# Altium schematic sheet ADC.SchDoc
size A2; SheetNumber: 36; SheetTotal: 36
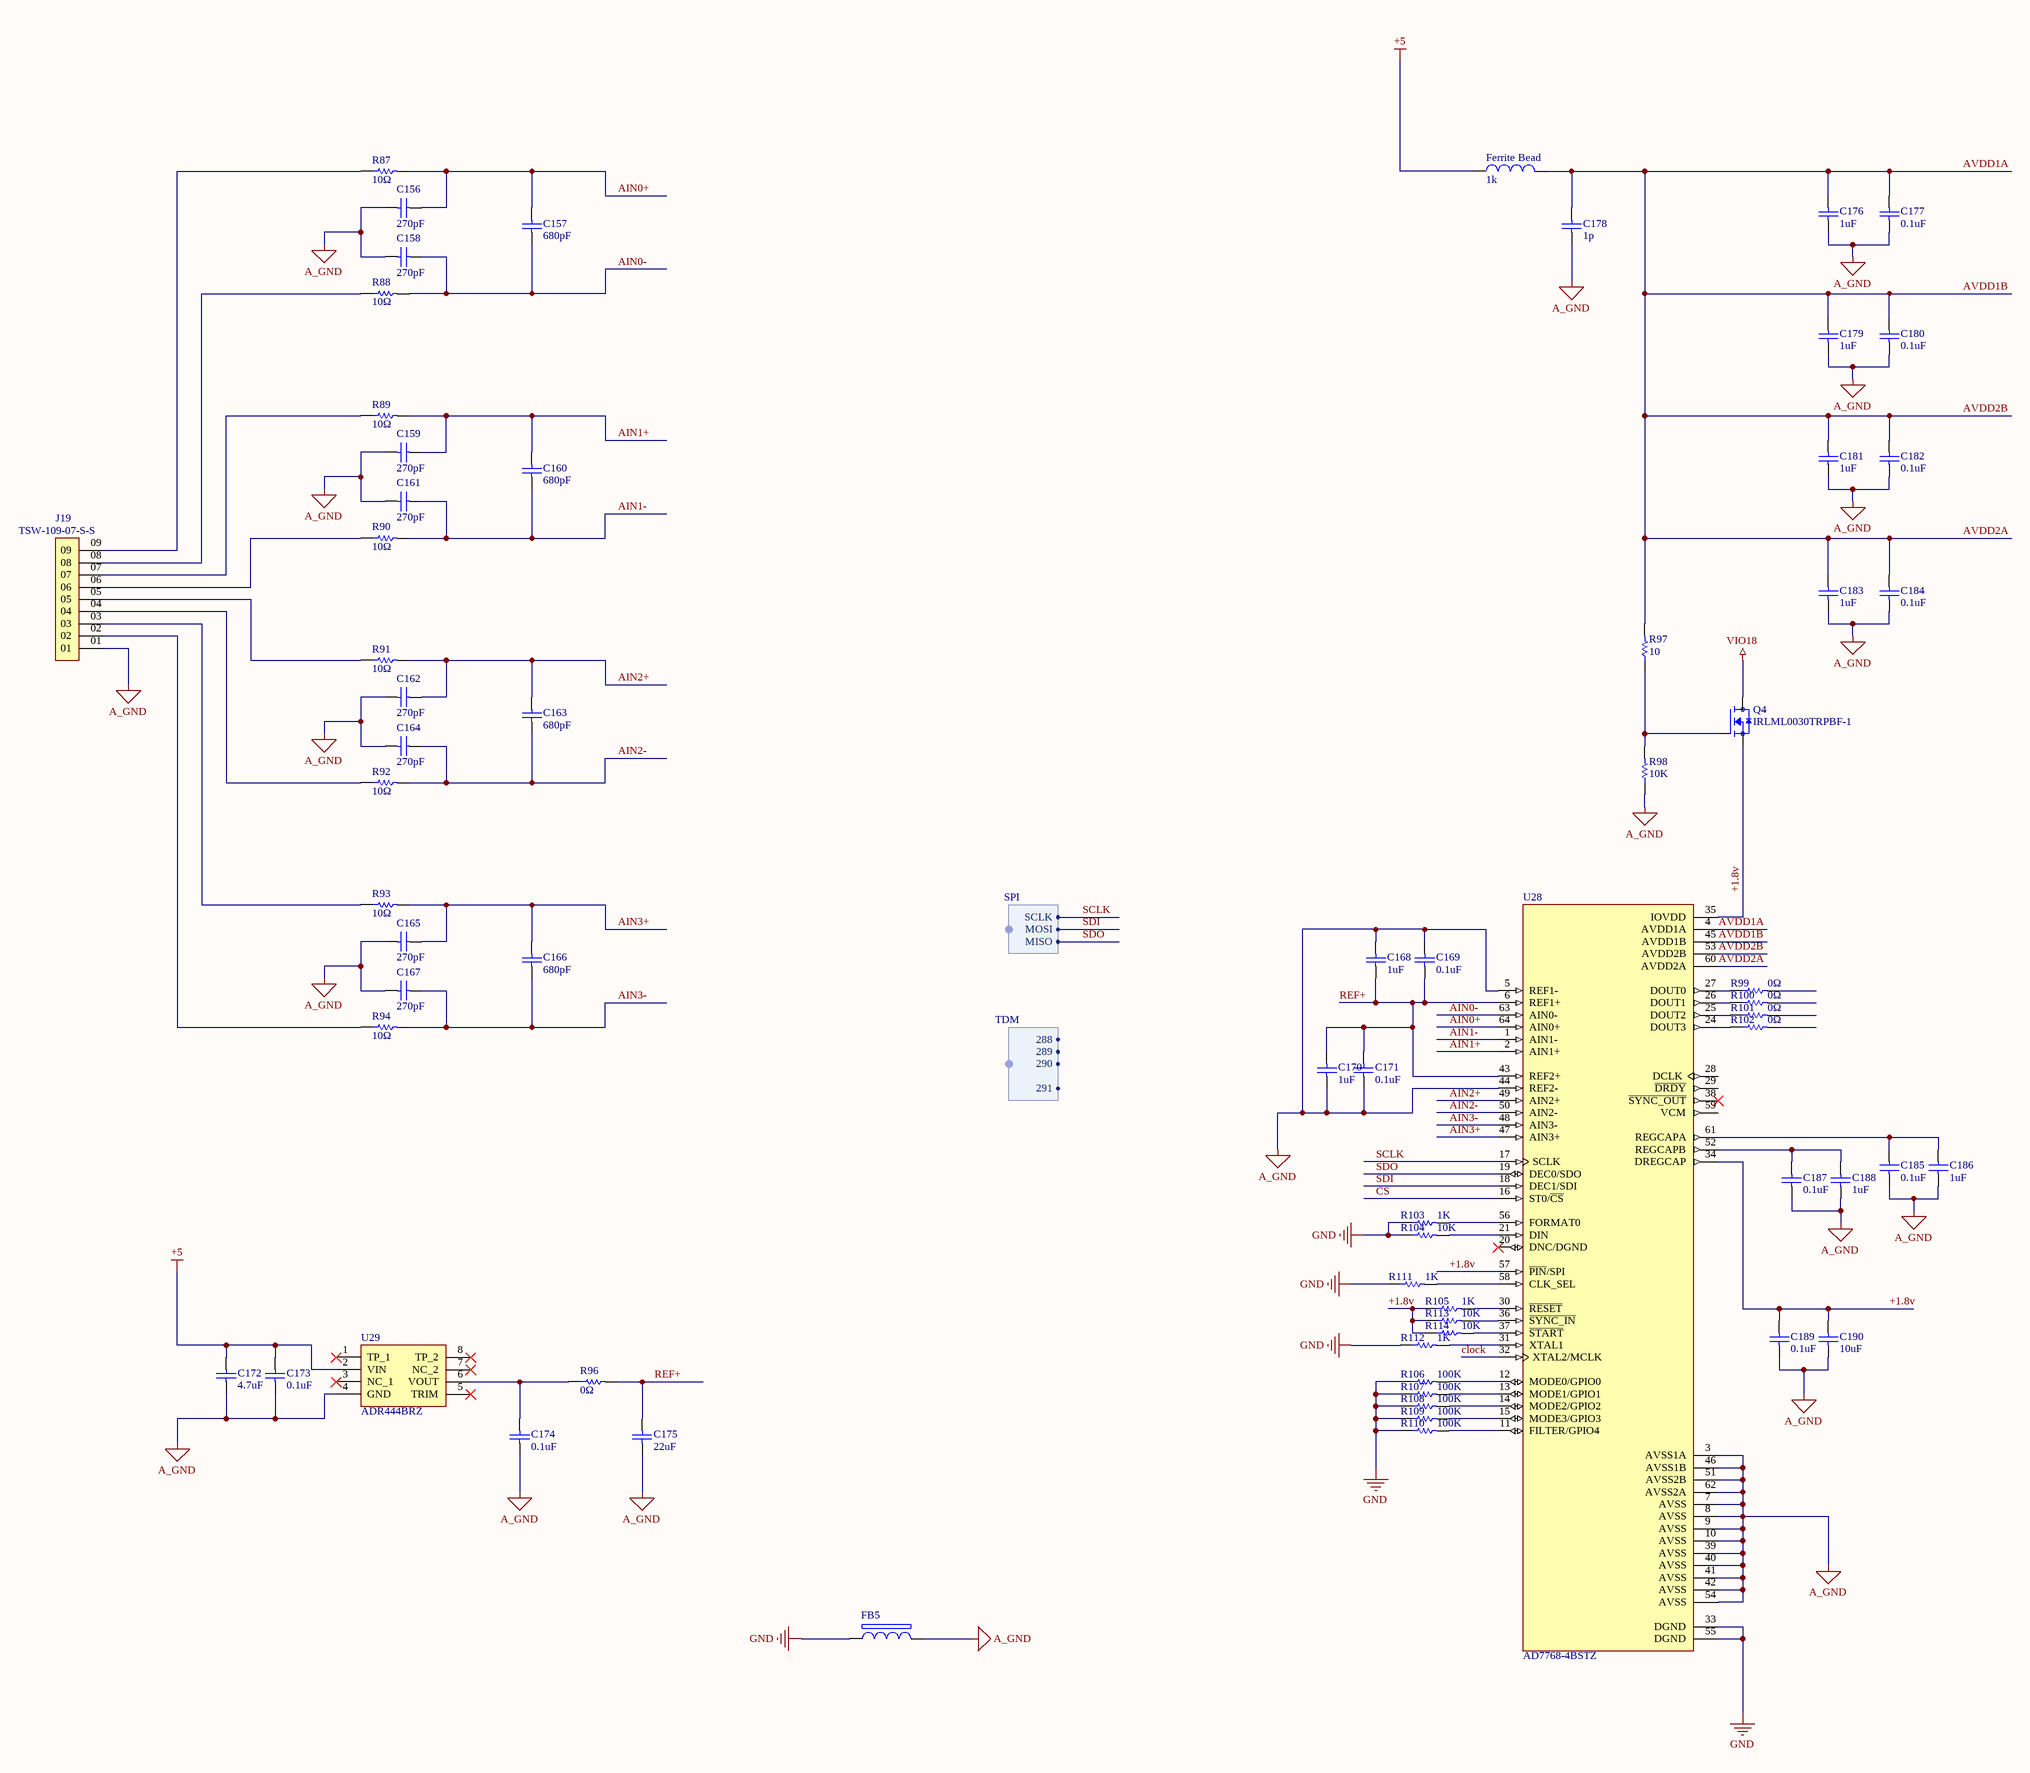
[diagram p0: ADC.SchDoc]

## Parts
C156  value 270pF  (hidden comment: Capacitor)
C157  value 680pF  (hidden comment: Capacitor)
C158  value 270pF  (hidden comment: Capacitor)
C159  value 270pF  (hidden comment: Capacitor)
C160  value 680pF  (hidden comment: Capacitor)
C161  value 270pF  (hidden comment: Capacitor)
C162  value 270pF  (hidden comment: Capacitor)
C163  value 680pF  (hidden comment: Capacitor)
C164  value 270pF  (hidden comment: Capacitor)
C165  value 270pF  (hidden comment: Capacitor)
C166  value 680pF  (hidden comment: Capacitor)
C167  value 270pF  (hidden comment: Capacitor)
C168  value 1uF  (hidden comment: Capacitor)
C169  value 0.1uF  (hidden comment: Capacitor)
C170  value 1uF  (hidden comment: Capacitor)
C171  value 0.1uF  (hidden comment: Capacitor)
C172  value 4.7uF  (hidden comment: Capacitor)
C173  value 0.1uF  (hidden comment: Capacitor)
C174  value 0.1uF  (hidden comment: Capacitor)
C175  value 22uF  (hidden comment: Capacitor)
C176  value 1uF  (hidden comment: Capacitor)
C177  value 0.1uF  (hidden comment: Capacitor)
C178  value 1p  (hidden comment: Capacitor)
C179  value 1uF  (hidden comment: Capacitor)
C180  value 0.1uF  (hidden comment: Capacitor)
C181  value 1uF  (hidden comment: Capacitor)
C182  value 0.1uF  (hidden comment: Capacitor)
C183  value 1uF  (hidden comment: Capacitor)
C184  value 0.1uF  (hidden comment: Capacitor)
C185  value 0.1uF  (hidden comment: Capacitor)
C186  value 1uF  (hidden comment: Capacitor)
C187  value 0.1uF  (hidden comment: Capacitor)
C188  value 1uF  (hidden comment: Capacitor)
C189  value 0.1uF  (hidden comment: Capacitor)
C190  value 10uF  (hidden comment: Capacitor)
FB5  BLM18KG121TN1D  [BLM18EG101TH1D]  (value not drawn)
Ferrite_Bead  value 1k  (hidden comment: Inductor)
J19  TSW-109-07-S-S  [SAMTEC_TSW-109-07-S-S]
Q4  IRLML0030TRPBF-1  [SOT95P237X112-3N]
R87  value 10Ω  (hidden comment: Resistor)
R88  value 10Ω  (hidden comment: Resistor)
R89  value 10Ω  (hidden comment: Resistor)
R90  value 10Ω  (hidden comment: Resistor)
R91  value 10Ω  (hidden comment: Resistor)
R92  value 10Ω  (hidden comment: Resistor)
R93  value 10Ω  (hidden comment: Resistor)
R94  value 10Ω  (hidden comment: Resistor)
R96  value 0Ω  (hidden comment: Resistor)
R97  value 10  (hidden comment: Resistor)
R98  value 10K  (hidden comment: Resistor)
R99  value 0Ω  (hidden comment: Resistor)
R100  value 0Ω  (hidden comment: Resistor)
R101  value 0Ω  (hidden comment: Resistor)
R102  value 0Ω  (hidden comment: Resistor)
R103  value 1K  (hidden comment: Resistor)
R104  value 10K  (hidden comment: Resistor)
R105  value 1K  (hidden comment: Resistor)
R106  value 100K  (hidden comment: Resistor)
R107  value 100K  (hidden comment: Resistor)
R108  value 100K  (hidden comment: Resistor)
R109  value 100K  (hidden comment: Resistor)
R110  value 100K  (hidden comment: Resistor)
R111  value 1K  (hidden comment: Resistor)
R112  value 1K  (hidden comment: Resistor)
R113  value 10K  (hidden comment: Resistor)
R114  value 10K  (hidden comment: Resistor)
U28  AD7768-4BSTZ  [QFP50P1200X1200X160-64N]
U29  ADR444BRZ  [SOIC127P600X175-8N]

## Harnesses
SPI: SCLK, MOSI, MISO
TDM: 288, 289, 290, 291

## Nets
+5: C172.2 C173.2 Ferrite_Bead.1 U29.2(VIN)
A_GND: C156.1 C158.1 C159.1 C161.1 C162.1 C164.1 C165.1 C167.1 C168.2 C169.2 C170.1 C171.1 C172.1 C173.1 C174.1 C175.1 C176.1 C177.1 C178.2 C179.1 C180.1 C181.1 C182.1 C183.1 C184.1 C185.1 C186.1 C187.1 C188.1 C189.1 C190.1 FB5.2 J19.01 R98.1 U28.3(AVSS1A) U28.5(REF1-) U28.7(AVSS) U28.8(AVSS) U28.9(AVSS) U28.10(AVSS) U28.39(AVSS) U28.40(AVSS) U28.41(AVSS) U28.42(AVSS) U28.44(REF2-) U28.46(AVSS1B) U28.51(AVSS2B) U28.54(AVSS) U28.62(AVSS2A) U29.4(GND)
GND: FB5.1 R103.1 R104.1 R106.1 R107.1 R108.1 R109.1 R110.1 R111.1 R112.1 U28.33(DGND) U28.55(DGND)
VIO18: Q4.3(D)
+1.8v: C189.2 C190.2 Q4.2(S) R105.1 R113.1 R114.1 U28.34(DREGCAP) U28.35(IOVDD) U28.57(~{PIN}/SPI)
AIN0+: C156.2 C157.2 R87.2 U28.64(AIN0+)
AIN0-: C157.1 C158.2 R88.2 U28.63(AIN0-)
AIN1+: C159.2 C160.2 R89.2 U28.2(AIN1+)
AIN1-: C160.1 C161.2 R90.2 U28.1(AIN1-)
AIN2+: C162.2 C163.2 R91.2 U28.49(AIN2+)
AIN2-: C163.1 C164.2 R92.2 U28.50(AIN2-)
AIN3+: C165.2 C166.2 R93.2 U28.47(AIN3+)
AIN3-: C166.1 C167.2 R94.2 U28.48(AIN3-)
AVDD1A: C176.2 C177.2 C178.1 C179.2 C180.2 C181.2 C182.2 C183.2 C184.2 Ferrite_Bead.2 R97.2 U28.4(AVDD1A) U28.45(AVDD1B) U28.53(AVDD2B) U28.60(AVDD2A)  [also labelled AVDD1B, AVDD2A, AVDD2B]
clock: U28.32(XTAL2/MCLK)
CS: U28.16(ST0/~{CS})
REF+: C168.1 C169.1 C170.2 C171.2 C175.2 R96.2 U28.6(REF1+) U28.43(REF2+)
SCLK: U28.17(SCLK) ; harness SPI.SCLK
SDI: U28.18(DEC1/SDI) ; harness SPI.MOSI
SDO: U28.19(DEC0/SDO) ; harness SPI.MISO
NetC174_2: C174.2 R96.1 U29.6(VOUT)
NetC185_2: C185.2 C186.2 U28.61(REGCAPA)
NetC187_2: C187.2 C188.2 U28.52(REGCAPB)
NetJ19_02: J19.02 R94.1
NetJ19_03: J19.03 R93.1
NetJ19_04: J19.04 R92.1
NetJ19_05: J19.05 R91.1
NetJ19_06: J19.06 R90.1
NetJ19_07: J19.07 R89.1
NetJ19_08: J19.08 R88.1
NetJ19_09: J19.09 R87.1
NetQ4_1: Q4.1(G) R97.1 R98.2
NetR99_1: R99.1 U28.27(DOUT0)
NetR100_1: R100.1 U28.26(DOUT1)
NetR101_1: R101.1 U28.25(DOUT2)
NetR102_1: R102.1 U28.24(DOUT3)
NetR103_2: R103.2 U28.56(FORMAT0)
NetR104_2: R104.2 U28.21(DIN)
NetR105_2: R105.2 U28.30(~{RESET})
NetR106_2: R106.2 U28.12(MODE0/GPIO0)
NetR107_2: R107.2 U28.13(MODE1/GPIO1)
NetR108_2: R108.2 U28.14(MODE2/GPIO2)
NetR109_2: R109.2 U28.15(MODE3/GPIO3)
NetR110_2: R110.2 U28.11(FILTER/GPIO4)
NetR111_2: R111.2 U28.58(CLK_SEL)
NetR112_2: R112.2 U28.31(XTAL1)
NetR113_2: R113.2 U28.36(~{SYNC_IN})
NetR114_2: R114.2 U28.37(~{START})

Not connected (* = marked no-connect by the designer): R99 2; R100 2; R101 2; R102 2; U28 20(DNC/DGND)* 28(DCLK) 29(~{DRDY}) 38(~{SYNC_OUT})* 59(VCM); U29 1(TP_1)* 3(NC_1)* 5(TRIM)* 7(NC_2)* 8(TP_2)*

## Library data of the parts
C156-C190 = Capacitor: SimulationGenericComponent: True
FB5 = BLM18KG121TN1D: Ferrite Bead. 0603. 3A.  DC Resistance(DCR) 30mΩ. 120Ω@100MHz; Manufacturer_Name: Murata Electronics; Datasheet Link: http://www.murata.com/~/media/webrenewal/support/library/catalog/products/emc/emifil/c31e.ashx?la=en-gb; Height: 0.75mm; Manufacturer_Part_Number: BLM18KG121TN1D; Mouser Part Number: 81-BLM18KG121TN1D; Mouser Price/Stock: https://www.mouser.co.uk/ProductDetail/Murata-Electronics/BLM18KG121TN1D?qs=rvfpa0%252BU10PYAwVv0fw24Q%3D%3D; Arrow Part Number: BLM18KG121TN1D; Arrow Price/Stock: https://www.arrow.com/en/products/blm18kg121tn1d/murata-manufacturing?utm_currency=USD&region=nac
Ferrite_Bead = Inductor: SimulationGenericComponent: True
J19 = TSW-109-07-S-S: Connector Header Through Hole 9 position 0.100 (2.54mm)
Q4 = IRLML0030TRPBF-1: Mosfet, 30v, 5.2a, 28 Mohm, 3.6 Nc Qg, Sot-23
R87-R94 R96-R114 = Resistor: TC1: 0; SimulationGenericComponent: True; TC2: 0
U28 = AD7768-4BSTZ: 4-Channel, 24-Bit, Simultaneous Sampling ADC, Power Scaling, 110.8 kHz BW
U29 = ADR444BRZ: Integrated Circuit; Manufacturer_Name: Analog Devices; Datasheet Link: https://datasheet.datasheetarchive.com/originals/distributors/SFDatasheet-4/sf-00085539.pdf; Height: 1.75mm; Manufacturer_Part_Number: ADR444BRZ; Mouser Part Number: 584-ADR444BRZ; Mouser Price/Stock: https://www.mouser.co.uk/ProductDetail/Analog-Devices/ADR444BRZ?qs=WIvQP4zGaniGi1GotCNCxA%3D%3D; Arrow Part Number: ADR444BRZ; Arrow Price/Stock: https://www.arrow.com/en/products/adr444brz/analog-devices?region=europe